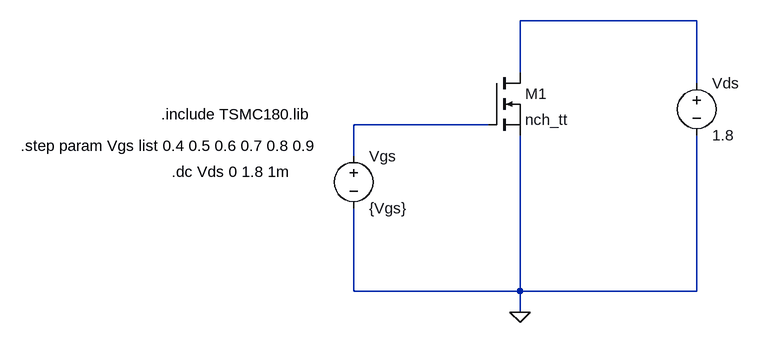
[diagram p0: schematic Q4.asc]
Q4.asc, the LTspice schematic file:
Version 4
SHEET 1 880 680
WIRE 624 -64 352 -64
WIRE 352 16 352 -64
WIRE 624 32 624 -64
WIRE 304 96 96 96
WIRE 96 144 96 96
WIRE 96 352 96 224
WIRE 352 352 352 112
WIRE 352 352 96 352
WIRE 624 352 624 112
WIRE 624 352 352 352
WIRE 352 384 352 352
FLAG 352 384 0
SYMBOL voltage 96 128 R0
SYMATTR InstName Vgs
SYMATTR Value {Vgs}
SYMBOL voltage 624 16 R0
SYMATTR InstName Vds
SYMATTR Value 1.8
SYMBOL nmos 304 16 R0
SYMATTR InstName M1
SYMATTR Value nch_tt
SYMATTR Value2 l=10u w=15u
TEXT -200 80 Left 2 !.include TSMC180.lib
TEXT -416 128 Left 2 !.step param Vgs list 0.4 0.5 0.6 0.7 0.8 0.9
TEXT -184 168 Left 2 !.dc Vds 0 1.8 1m

The netlist it stands for:
* Q4.asc
Vgs N002 0 {Vgs}
Vds N001 0 1.8
M1 N001 N002 0 0 nch_tt l=10u w=15u
.model NMOS NMOS
.model PMOS PMOS
.lib standard.mos
.include TSMC180.lib
.step param Vgs list 0.4 0.5 0.6 0.7 0.8 0.9
.dc Vds 0 1.8 1m
.backanno
.end